# EAGLE design pololu-steppers-signal-side (EAGLE 5.06)
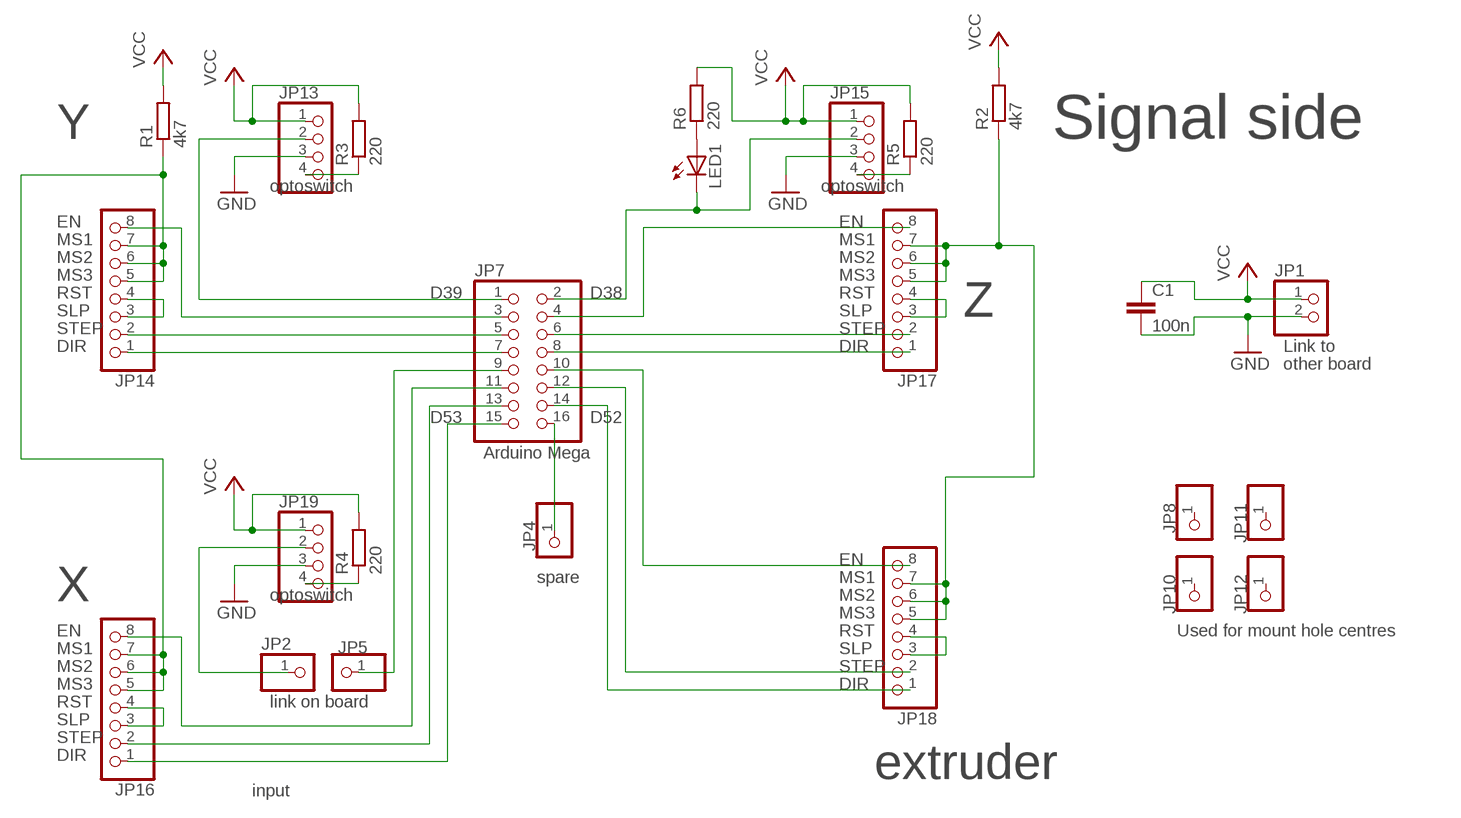
[diagram p0: schematic, sheet 1]

## Parts
C1  100n  C-EU025-024X044  [C025-024X044]
JP1  PINHD-1X2  [1X02]
JP2  PINHD-1X1  [1X01]
JP4  PINHD-1X1  [1X01]
JP5  PINHD-1X1  [1X01]
JP7  PINHD-2X8  [2X08]
JP8  PINHD-1X1  [1X01]
JP10  PINHD-1X1  [1X01]
JP11  PINHD-1X1  [1X01]
JP12  PINHD-1X1  [1X01]
JP13  PINHD-1X4  [1X04]
JP14  PINHD-1X8  [1X08]
JP15  PINHD-1X4  [1X04]
JP16  PINHD-1X8  [1X08]
JP17  PINHD-1X8  [1X08]
JP18  PINHD-1X8  [1X08]
JP19  PINHD-1X4  [1X04]
LED1  LED3MM  [LED3MM]
R1  4k7  R-EU_0204/5  [0204/5]
R2  4k7  R-EU_0204/5  [0204/5]
R3  220  R-EU_0204/5  [0204/5]
R4  220  R-EU_0204/5  [0204/5]
R5  220  R-EU_0204/5  [0204/5]
R6  220  R-EU_0204/5  [0204/5]

## Nets
EDIR: JP7.14 JP18.1
EEN: JP7.10 JP18.8
ESTEP: JP7.12 JP18.2
GND: C1.2 JP1.2 JP13.3 JP15.3 JP19.3
MICROSTEP1: JP17.5 JP17.6 JP17.7 JP18.5 JP18.6 JP18.7 R2.1
MICROSTEP2: JP14.5 JP14.6 JP14.7 JP16.5 JP16.6 JP16.7 R1.1
N$1: JP2.1 JP19.2
N$2: JP16.3 JP16.4
N$3: JP4.1 JP7.16
N$6: LED1.A R6.1
N$7: JP14.3 JP14.4
N$8: JP15.4 R5.1
N$10: JP13.4 R3.1
N$12: JP19.4 R4.1
N$22: JP17.3 JP17.4
N$32: JP18.3 JP18.4
VCC: C1.1 JP1.1 JP13.1 JP15.1 JP19.1 R1.2 R2.2 R3.2 R4.2 R5.2 R6.2
XDIR: JP7.15 JP16.1
XEN: JP7.11 JP16.8
XOPT: JP5.1 JP7.9
XSTEP: JP7.13 JP16.2
YDIR: JP7.7 JP14.1
YEN: JP7.3 JP14.8
YOPT: JP7.1 JP13.2
YSTEP: JP7.5 JP14.2
ZDIR: JP7.8 JP17.1
ZEN: JP7.4 JP17.8
ZOPT: JP7.2 JP15.2 LED1.K(C)
ZSTEP: JP7.6 JP17.2
Unconnected: JP8.1 JP10.1 JP11.1 JP12.1

## Notes on the sheet
- Y | Signal side
- optoswitch | optoswitch
- EN | EN
- MS1 | MS1
- MS2 | MS2
- MS3 | MS3
- RST | D39 | D38 | RST
- SLP | SLP | Z
- STEP | STEP
- DIR | DIR | Link to
- other board
- D53 | D52
- Arduino Mega
- EN
- spare | MS1
- X | optoswitch | MS2
- MS3
- EN | RST | Used for mount hole centres
- MS1 | SLP
- MS2 | STEP
- MS3 | DIR
- RST | link on board
- SLP
- STEP
- DIR
- extruder
- input

## Library data of the parts
C1 = rcl:C-EU: CAPACITOR, European symbol
JP1 = pinhead:PINHD-1X2: PIN HEADER
JP2 JP4 JP5 JP8 JP10-JP12 = pinhead:PINHD-1X1: PIN HEADER
JP7 = pinhead:PINHD-2X8: PIN HEADER
JP13 JP15 JP19 = pinhead:PINHD-1X4: PIN HEADER
JP14 JP16-JP18 = pinhead:PINHD-1X8: PIN HEADER
LED1 = led:LED: LED OSRAM: - CHIPLED LG R971, LG N971, LY N971, LG Q971, LY Q971, LO R971, LY R971 LH N974, LH R974 LS Q976, LO Q976, LY Q976 LO Q996 - Hyper CHIPLED LW Q18S LB Q993, LB Q99A, LB R99A - SideLED LS A670, LO A670, LY A670, LG A670, LP A670 LB A673, LV A673, LT A673, LW A673 LH A674 LY A675 LS A676, LA A676, LO A676, LY A676, LW A676 LS A679, LY A679, LG A679 - Hyper Micro SIDELED® LS Y876, LA Y876, LO Y876, LY Y876 LT Y87S - SmartLED LW L88C, LW L88S LB L89C, LB L89S, LG L890 LS L89K, LO L89K, LY L89K LS L896, LA L896, LO L896, LY L896 - TOPLED LS T670, LO T670, LY T670, LG T670, LP T670 LSG T670, LSP T670, LSY T670, LOP T670, LYG T670 LG T671, LOG T671, LSG T671 LB T673, LV T673, LT T673, LW T673 LH T674 LS T676, LA T676, LO T676, LY T676, LB T676, LH T676, LSB T676, LW T676 LB T67C, LV T67C, LT T67C, LS T67K, LO T67K, LY T67K, LW E67C LS E67B, LA E67B, LO E67B, LY E67B, LB E67C, LV E67C, LT E67C LW T67C LS T679, LY T679, LG T679 LS T770, LO T770, LY T770, LG T770, LP T770 LB T773, LV T773, LT T773, LW T773 LH T774 LS E675, LA E675, LY E675, LS T675 LS T776, LA T776, LO T776, LY T776, LB T776 LHGB T686 LT T68C, LB T68C - Hyper Mini TOPLED® LB M676 - Mini TOPLED Santana® LG M470 LS M47K, LO M47K, LY M47K Source: http://www.osram.convergy.de LUXEON: - LUMILED® LXK2-PW12-R00, LXK2-PW12-S00, LXK2-PW14-U00, LXK2-PW14-V00 LXK2-PM12-R00, LXK2-PM12-S00, LXK2-PM14-U00 LXK2-PE12-Q00, LXK2-PE12-R00, LXK2-PE12-S00, LXK2-PE14-T00, LXK2-PE14-U00 LXK2-PB12-K00, LXK2-PB12-L00, LXK2-PB12-M00, LXK2-PB14-N00, LXK2-PB14-P00, LXK2-PB14-Q00 LXK2-PR12-L00, LXK2-PR12-M00, LXK2-PR14-Q00, LXK2-PR14-R00 LXK2-PD12-Q00, LXK2-PD12-R00, LXK2-PD12-S00 LXK2-PH12-R00, LXK2-PH12-S00 LXK2-PL12-P00, LXK2-PL12-Q00, LXK2-PL12-R00 Source: www.luxeon.com KINGBRIGHT: KA-3528ASYC Source: www.kingbright.com
R1-R6 = rcl:R-EU_: RESISTOR, European symbol

## Board
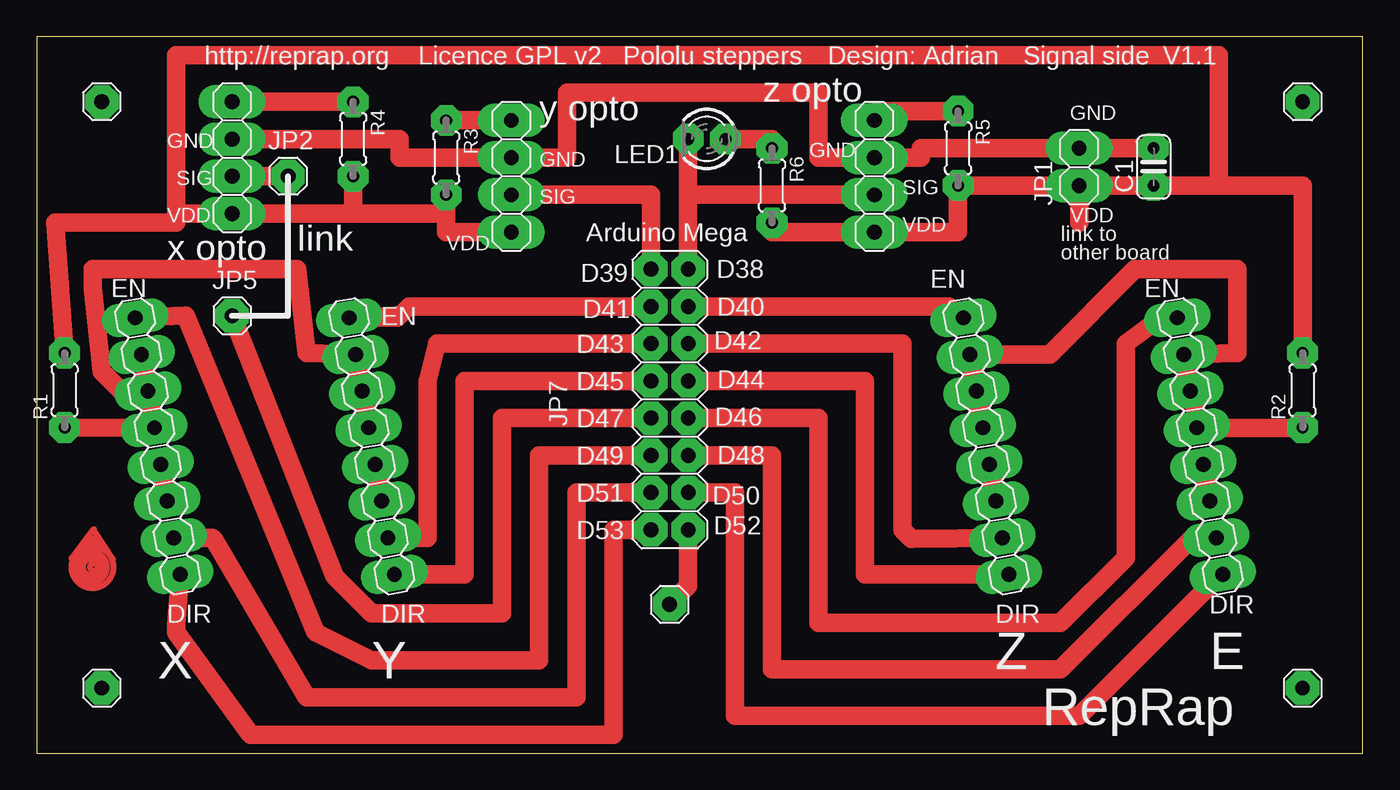
[diagram p1: board, top side]

Size 90.47 x 48.88 mm. Coordinates in mm from the lower left corner, seen from the top.
Outline: 0,0 90.47,0 90.47,48.88 0,48.88 0,0
Copper layers (1*16): Top 0.035mm / dielectric 1.5mm / Bottom 0.035mm
Design rules "default *": minimum track width 10mil, minimum drill 24mil, track to track 8mil, track to pad 8mil, pad to pad 8mil, via to via 8mil, smd to smd 8mil, copper to edge 40mil, drill to drill 8mil, minimum pad ring 25mil, minimum via ring 8mil, stop-mask expansion 4mil, vias tented up to drill 0mil, thermal gap 10mil

### Footprints (pad centres in the part's own frame; a part is rotated, then mirrored left to right if it is on the bottom)
C025-024X044 = drill 0.813 octagon: 1 -1.27,0; 2 1.27,0
1X02 = drill 1.016 long: 1 -1.27,0; 2 1.27,0
1X01 = drill 1.016 octagon: 1 0,0
2X08 = drill 1.016 octagon: 1 -8.89,-1.27; 2 -8.89,1.27; 3 -6.35,-1.27; 4 -6.35,1.27; 5 -3.81,-1.27; 6 -3.81,1.27; 7 -1.27,-1.27; 8 -1.27,1.27; 9 1.27,-1.27; 10 1.27,1.27; 11 3.81,-1.27; 12 3.81,1.27; 13 6.35,-1.27; 14 6.35,1.27; 15 8.89,-1.27; 16 8.89,1.27
1X04 = drill 1.016 long: 1 -3.81,0; 2 -1.27,0; 3 1.27,0; 4 3.81,0
1X08 = drill 1.016 long: 1 -8.89,0; 2 -6.35,0; 3 -3.81,0; 4 -1.27,0; 5 1.27,0; 6 3.81,0; 7 6.35,0; 8 8.89,0
LED3MM = drill 0.813 octagon: A -1.27,0; K 1.27,0
0204/5 = drill 0.813 octagon: 1 -2.54,0; 2 2.54,0

### Placement (x,y rotation side)
C1  76.2,40.01 90 top
JP1  71.12,40.01 90 top
JP2  17.14,39.37 0 top
JP4  43.18,10.16 0 top
JP5  13.34,29.84 0 top
JP7  43.18,24.13 270 top
JP8  4.45,44.45 0 top
JP10  4.45,4.45 0 top
JP11  86.36,44.45 0 top
JP12  86.36,4.45 0 top
JP13  32.38,39.37 90 top
JP14  22.86,20.95 100 top
JP15  57.15,39.37 90 top
JP16  8.26,20.95 100 top
JP17  64.77,20.95 100 top
JP18  79.38,20.95 100 top
JP19  13.34,40.64 90 top
LED1  45.72,41.91 180 top
R1  1.91,24.77 90 top
R2  86.36,24.77 90 top
R3  27.94,40.64 270 top
R4  21.59,41.91 270 top
R5  62.87,41.27 270 top
R6  50.16,38.73 270 top

### Tracks (layer width: path | path; a pad name or v marks a point on that pad's centre or on a via)
EDIR
  Top 1.27: JP18.1 80.78,12.2 71.12,2.54 54.61,2.54 | 54.61,2.54 53.98,2.54 | JP7.14 47.62,17.78 47.62,2.54 54.61,2.54
EEN
  Top 1.27: JP18.8 76.7,29.71 74.3,27.94 74.3,13.34 69.85,8.89 53.34,8.89 53.34,22.86 JP7.10
ESTEP
  Top 1.27: JP18.2 78.84,14.7 69.85,5.71 54.61,5.71 | 54.61,5.71 53.98,5.71 | JP7.12 50.16,20.32 50.16,5.71 54.61,5.71
GND
  Top 1.27: C1.2 JP1.2 60.33,41.27 60.33,40.64 | JP19.3 24.77,41.91 24.77,40.64 JP13.3 36.2,40.64 36.2,45.09 53.34,45.09 53.34,40.64 60.33,40.64 | 60.33,40.64 JP15.3
MICROSTEP1  (1 unrouted)
  Top 1.27: 86.34,22.21 JP18.5 79.38,22.23 JP18.6 JP18.7 81.92,27.3 81.92,33.02 74.93,33.02 69.12,27.21 JP17.7 JP17.6 JP17.5
MICROSTEP2
  Top 1.27: JP16.6 5.77,24.71 4.45,26.04 3.81,31.75 3.81,33.02 17.78,33.02 18.41,27.3 JP14.7 JP14.6 JP14.5 | R1.1 JP16.5 JP16.6 | JP16.6 JP16.7
N$1
  Top 1.27: JP19.2 JP2.1
N$2
  Top 1.27: JP16.3 JP16.4
N$3
  Top 1.27: JP7.16 44.45,11.43 JP4.1
N$4
  Top 0.406: 2.37,13.31 2.44,13.31 3.89,15.29 3.89,15.21 5.19,13.23
N$5
  Top 0.406: 3.89,14.68 3.89,14.38 3.59,14.07 3.59,14.45 3.51,14.53 3.89,14.53 4.28,14.15
N$6
  Top 1.27: LED1.A 50.16,41.91 R6.1
N$7
  Top 1.27: JP14.3 JP14.4
N$8
  Top 1.27: R5.1 57.15,43.81 JP15.4
N$10
  Top 1.27: R3.1 JP13.4
N$12
  Top 1.27: JP19.4 R4.1
N$22
  Top 1.27: JP17.3 JP17.4
N$32
  Top 1.27: JP18.3 JP18.4
VCC
  Top 1.27: 80.64,38.73 C1.1 | C1.1 JP1.1 | 80.64,38.73 86.36,38.73 R2.2 | JP1.1 71.12,36.2 | 9.53,36.83 9.53,36.2 1.27,36.2 R1.2 | 9.53,36.83 9.53,47.62 80.64,47.62 80.64,38.73 | C1.1 JP1.1 | 9.53,36.83 JP19.1 21.59,36.83 | 21.59,36.83 R4.2 | 27.94,37.47 27.94,36.83 21.59,36.83 | 27.94,37.47 R3.2 | JP13.1 27.94,35.56 27.94,37.47 | JP1.1 R5.2 62.87,35.56 JP15.1 50.16,35.56 R6.2
XDIR
  Top 1.27: JP7.15 39.37,15.24 39.37,1.27 14.61,1.27 9.53,8.26 9.53,8.75 JP16.1
XEN
  Top 1.27: JP7.11 34.29,20.32 34.29,6.35 22.86,6.35 19.05,8.26 10.16,29.84 JP16.8
XOPT
  Top 1.27: JP5.1 20.32,12.06 22.86,9.53 30.48,9.53 | 30.48,9.53 31.11,9.53 | JP7.9 31.75,22.86 31.75,9.53 30.48,9.53
XSTEP
  Top 1.27: JP7.13 36.83,17.78 36.83,3.81 18.41,3.81 12.06,14.61 11.97,14.7 JP16.2
YDIR
  Top 1.27: JP14.1 29.21,12.2 29.21,24.13 | 29.21,24.13 29.21,24.77 | JP7.7 29.21,25.4 29.21,24.13
YEN
  Top 1.27: 24.54,29.84 JP14.8 24.63,29.71 25.4,30.48 JP7.3
YOPT
  Top 1.27: JP13.2 41.91,38.1 JP7.1
YSTEP
  Top 1.27: JP14.2 26.67,14.7 26.67,25.4 27.3,27.94 JP7.5
ZDIR
  Top 1.27: 56.52,12.2 58.92,12.2 | 56.52,12.2 JP17.1 | JP7.8 56.52,25.4 56.52,12.2
ZEN
  Top 1.27: JP7.4 62.23,30.48 JP17.8
ZOPT
  Top 1.27: 44.45,38.1 JP15.2 | JP7.2 44.45,38.1 | 44.45,38.1 LED1.K
ZSTEP
  Top 1.27: JP7.6 59.05,27.94 59.05,15.24 59.69,14.61 JP17.2
(copper drawn outside any net)
  shapes: Top circle x6

### Text on the board
tPlace: http://reprap.org | Licence GPL v2 | Pololu steppers | Design: Adrian | Signal side | V1.1 | z opto | y opto | GND | GND | GND | GND | SIG | SIG | SIG | VDD | VDD | VDD | Arduino Mega | link to | x opto | link | VDD | other board | D39 | D38 | EN | EN | EN | D41 | D40 | EN | D42 | D43 | D45 | D44 | D47 | D46 | D49 | D48 | D51 | D50 | D53 | D52 | DIR | DIR | DIR | DIR | Z | E | X | Y | RepRap